# EAGLE design RAMPSXB (EAGLE 8.2.2)
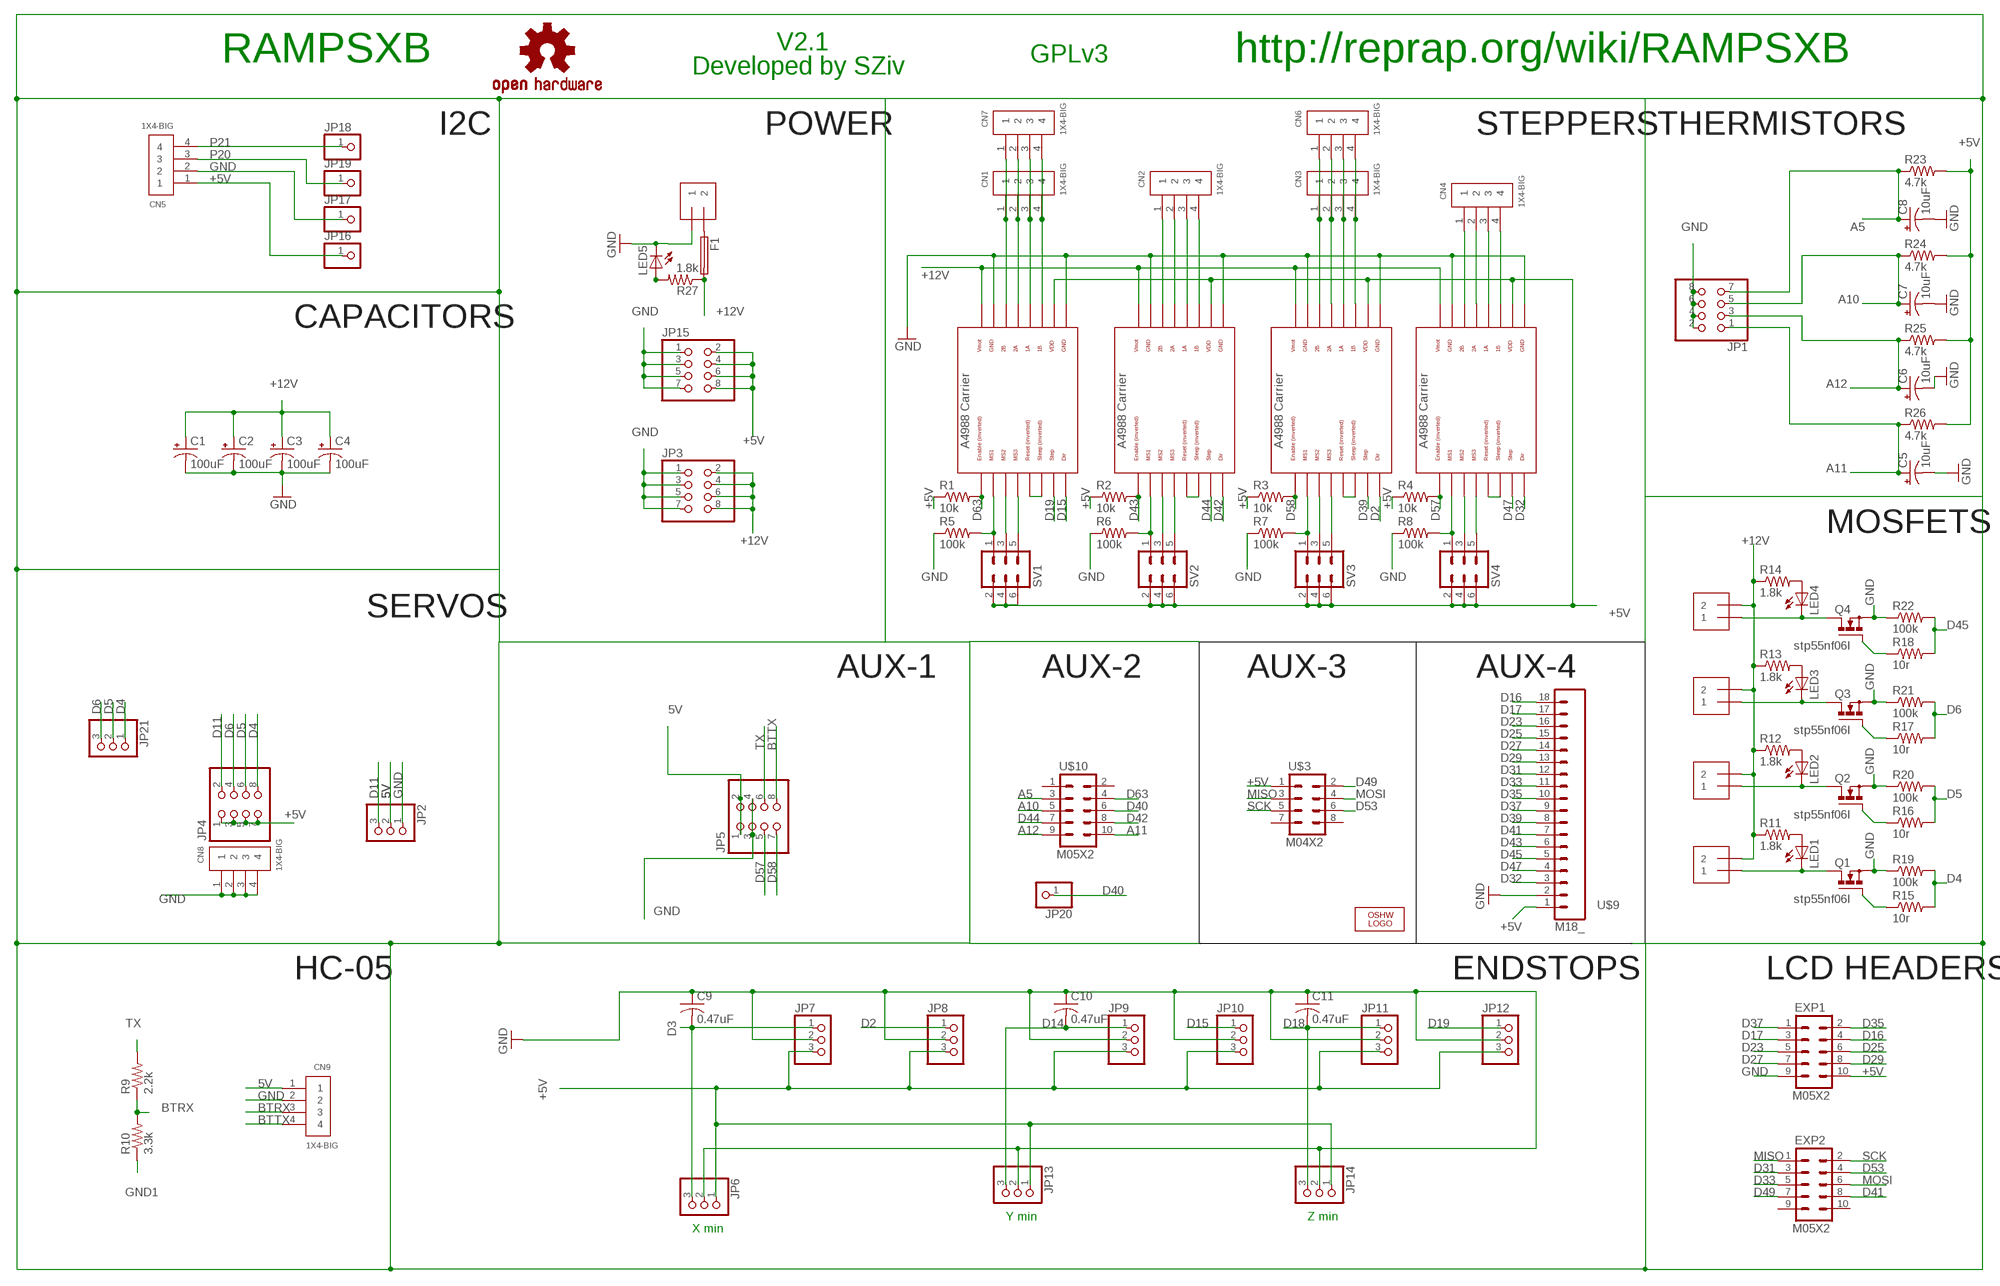
[diagram p0: schematic, sheet 1]

## Parts
C1  100uF  CPOL-US153CLV-0605  [153CLV-0605]
C2  100uF  CPOL-US153CLV-0605  [153CLV-0605]
C3  100uF  CPOL-US153CLV-0605  [153CLV-0605]
C4  100uF  CPOL-US153CLV-0605  [153CLV-0605]
C5  10uF  CPOL-US153CLV-0405  [153CLV-0405]
C6  10uF  CPOL-US153CLV-0405  [153CLV-0405]
C7  10uF  CPOL-US153CLV-0405  [153CLV-0405]
C8  10uF  CPOL-US153CLV-0405  [153CLV-0405]
C9  0.47uF  C-USC0805  [C0805]
C10  0.47uF  C-USC0805  [C0805]
C11  0.47uF  C-USC0805  [C0805]
CN1  1X4-BIG  [1X04-BIG]
CN2  1X4-BIG  [1X04-BIG]
CN3  1X4-BIG  [1X04-BIG]
CN4  1X4-BIG  [1X04-BIG]
CN5  1X4-BIG  [1X04-BIG]
CN6  1X4-BIG  [1X04-BIG]
CN7  1X4-BIG  [1X04-BIG]
CN8  1X4-BIG  [1X04-BIG]
CN9  1X4-BIG  [1X04-BIG]
EXP1  M05X2  [2X5]
EXP2  M05X2  [2X5]
F1  PTCFUSE  [LITTLEFUSE]
J1  1X2-3.5MM  [1X2-3.5MM]
J2  1X2-3.5MM  [1X2-3.5MM]
J3  1X2-3.5MM  [1X2-3.5MM]
J4  1X2-3.5MM  [1X2-3.5MM]
J5  1X2-3.5MM  [1X2-3.5MM]
JP1  PINHD-2X4  [2X04]
JP2  PINHD-1X3  [1X03]
JP3  PINHD-2X4  [2X04]
JP4  PINHD-2X4  [2X04]
JP5  PINHD-2X4  [2X04]
JP6  PINHD-1X3  [1X03]
JP7  PINHD-1X3  [1X03]
JP8  PINHD-1X3  [1X03]
JP9  PINHD-1X3  [1X03]
JP10  PINHD-1X3  [1X03]
JP11  PINHD-1X3  [1X03]
JP12  PINHD-1X3  [1X03]
JP13  PINHD-1X3  [1X03]
JP14  PINHD-1X3  [1X03]
JP15  PINHD-2X4  [2X04]
JP16  PINHD-1X1  [1X01]
JP17  PINHD-1X1  [1X01]
JP18  PINHD-1X1  [1X01]
JP19  PINHD-1X1  [1X01]
JP20  PINHD-1X1  [1X01]
JP21  PINHD-1X3  [1X03]
LED1  LEDCHIPLED_0805  [CHIPLED_0805]
LED2  LEDCHIPLED_0805  [CHIPLED_0805]
LED3  LEDCHIPLED_0805  [CHIPLED_0805]
LED4  LEDCHIPLED_0805  [CHIPLED_0805]
LED5  LEDCHIPLED_0805  [CHIPLED_0805]
LOGO1  OSHW_LOGO_6MILX0100-NT  [OSHW_6X100_NOTEXT]
LOGO2  OSHW-LOGOL  [OSHW-LOGO-L]
Q1  IRF512  [TO220BV]
Q2  IRF512  [TO220BV]
Q3  IRF512  [TO220BV]
Q4  IRF512  [TO220BV]
R1  10k  R-US_M0805  [M0805]
R2  10k  R-US_M0805  [M0805]
R3  10k  R-US_M0805  [M0805]
R4  10k  R-US_M0805  [M0805]
R5  100k  R-US_M0805  [M0805]
R6  100k  R-US_M0805  [M0805]
R7  100k  R-US_M0805  [M0805]
R8  100k  R-US_M0805  [M0805]
R9  2.2k  R-US_M0805  [M0805]
R10  3.3k  R-US_M0805  [M0805]
R11  1.8k  R-US_M0805  [M0805]
R12  1.8k  R-US_M0805  [M0805]
R13  1.8k  R-US_M0805  [M0805]
R14  1.8k  R-US_M0805  [M0805]
R15  10r  R-US_M0805  [M0805]
R16  10r  R-US_M0805  [M0805]
R17  10r  R-US_M0805  [M0805]
R18  10r  R-US_M0805  [M0805]
R19  100k  R-US_M0805  [M0805]
R20  100k  R-US_M0805  [M0805]
R21  100k  R-US_M0805  [M0805]
R22  100k  R-US_M0805  [M0805]
R23  4.7k  R-US_R0805  [R0805]
R24  4.7k  R-US_R0805  [R0805]
R25  4.7k  R-US_R0805  [R0805]
R26  4.7k  R-US_R0805  [R0805]
R27  1.8k  R-US_M0805  [M0805]
SV1  MA03-2  [MA03-2]
SV2  MA03-2  [MA03-2]
SV3  MA03-2  [MA03-2]
SV4  MA03-2  [MA03-2]
U$1  POLOLU_A4983CARRIER  [A4988BREAKOUT]
U$2  POLOLU_A4983CARRIER  [A4988BREAKOUT]
U$3  M04X2  [2X4]
U$4  POLOLU_A4983CARRIER  [A4988BREAKOUT]
U$5  POLOLU_A4983CARRIER  [A4988BREAKOUT]
U$9  M18_  [1X18]
U$10  M05X2  [2X5]

## Nets
5V: CN9.1 JP2.2 JP5.1 JP5.2
+5V: CN5.1 EXP1.10 JP4.1 JP4.3 JP4.5 JP4.7 JP6.1 JP7.3 JP8.3 JP9.3 JP10.3 JP11.3 JP12.3 JP13.1 JP14.1 JP15.2 JP15.4 JP15.6 JP15.8 JP16.1 R1.1 R2.1 R3.1 R4.1 R23.2 R24.2 R25.2 R26.2 SV1.2 SV1.4 SV1.6 SV2.2 SV2.4 SV2.6 SV3.2 SV3.4 SV3.6 SV4.2 SV4.4 SV4.6 U$1.VDD U$2.VDD U$3.1 U$4.VDD U$5.VDD U$9.1
+12V: C1.+ C2.+ C3.+ C4.+ F1.2 J2.2 J3.2 J4.2 J5.2 JP3.2 JP3.4 JP3.6 JP3.8 R11.1 R12.1 R13.1 R14.1 R27.1 U$1.VMOT U$2.VMOT U$4.VMOT U$5.VMOT
A5: C8.+ JP1.7 R23.1 U$10.3
A10: C7.+ JP1.5 R24.1 U$10.5
A11: C5.+ JP1.1 R26.1 U$10.10
A12: C6.+ JP1.3 R25.1 U$10.9
BTRX: CN9.3 R9.1 R10.2
BTTX: CN9.4 JP5.8
D2: JP8.1 U$4.DIR
D3: C9.2 JP6.3 JP7.1
D4: JP4.8 JP21.1 R15.2 R19.2
D5: JP4.6 JP21.2 R16.2 R20.2
D6: JP4.4 JP21.3 R17.2 R21.2
D11: JP2.3 JP4.2
D14: C10.2 JP9.1 JP13.3
D15: JP10.1 U$1.DIR
D16: EXP1.4 U$9.18
D17: EXP1.3 U$9.17
D18: C11.2 JP11.1 JP14.3
D19: JP12.1 U$1.STEP
D23: EXP1.5 U$9.16
D25: EXP1.6 U$9.15
D27: EXP1.7 U$9.14
D29: EXP1.8 U$9.13
D31: EXP2.3 U$9.12
D32: U$5.DIR U$9.3
D33: EXP2.5 U$9.11
D35: EXP1.2 U$9.10
D37: EXP1.1 U$9.9
D39: U$4.STEP U$9.8
D40: JP20.1 U$10.6
D41: EXP2.8 U$9.7
D42: U$2.DIR U$10.8
D43: R2.2 U$2.EN U$9.6
D44: U$2.STEP U$10.7
D45: R18.2 R22.2 U$9.5
D47: U$5.STEP U$9.4
D49: EXP2.7 U$3.2
D53: EXP2.4 U$3.6
D57: JP5.5 R4.2 U$5.EN
D58: JP5.7 R3.2 U$4.EN
D63: R1.2 U$1.EN U$10.4
GND: C1.- C2.- C3.- C4.- C5.- C6.- C7.- C8.- C9.1 C10.1 C11.1 CN5.2 CN8.1 CN8.2 CN8.3 CN8.4 CN9.2 EXP1.9 J1.1 JP1.2 JP1.4 JP1.6 JP1.8 JP2.1 JP3.1 JP3.3 JP3.5 JP3.7 JP5.3 JP5.4 JP6.2 JP7.2 JP8.2 JP9.2 JP10.2 JP11.2 JP12.2 JP13.2 JP14.2 JP15.1 JP15.3 JP15.5 JP15.7 JP17.1 LED5.C Q1.S Q2.S Q3.S Q4.S R5.1 R6.1 R7.1 R8.1 R19.1 R20.1 R21.1 R22.1 U$1.GND U$1.GND@0(GND) U$2.GND U$2.GND@0(GND) U$4.GND U$4.GND@0(GND) U$5.GND U$5.GND@0(GND) U$9.2
GND1: R10.1
MISO: EXP2.1 U$3.3
MOSI: EXP2.6 U$3.4
N$1: CN1.1 CN7.1 U$1.2B
N$2: LED5.A R27.2
N$3: CN1.3 CN7.3 U$1.1A
N$4: CN1.4 CN7.4 U$1.1B
N$5: CN2.1 U$2.2B
N$6: CN2.2 U$2.2A
N$7: CN2.3 U$2.1A
N$8: CN2.4 U$2.1B
N$9: CN3.1 CN6.1 U$4.2B
N$10: CN3.2 CN6.2 U$4.2A
N$11: CN3.3 CN6.3 U$4.1A
N$12: CN3.4 CN6.4 U$4.1B
N$13: CN4.1 U$5.2B
N$14: CN4.2 U$5.2A
N$15: CN4.3 U$5.1A
N$16: CN4.4 U$5.1B
N$17: F1.1 J1.2
N$18: R5.2 SV1.1 U$1.MS1
N$19: SV1.3 U$1.MS2
N$20: SV1.5 U$1.MS3
N$21: R6.2 SV2.1 U$2.MS1
N$22: SV2.3 U$2.MS2
N$23: SV2.5 U$2.MS3
N$24: R7.2 SV3.1 U$4.MS1
N$25: SV3.3 U$4.MS2
N$26: SV3.5 U$4.MS3
N$27: R8.2 SV4.1 U$5.MS1
N$28: SV4.3 U$5.MS2
N$29: SV4.5 U$5.MS3
N$30: J2.1 LED1.C Q1.D
N$32: U$2.RST U$2.SLP(SLEEP)
N$33: U$1.RST U$1.SLP(SLEEP)
N$34: U$4.RST U$4.SLP(SLEEP)
N$35: U$5.RST U$5.SLP(SLEEP)
N$36: J3.1 LED2.C Q2.D
N$37: J4.1 LED3.C Q3.D
N$38: J5.1 LED4.C Q4.D
N$39: LED1.A R11.2
N$40: LED2.A R12.2
N$41: LED3.A R13.2
N$42: LED4.A R14.2
N$44: CN1.2 CN7.2 U$1.2A
N$46: Q2.G R16.1
N$47: Q3.G R17.1
N$48: Q4.G R18.1
N$49: Q1.G R15.1
P20: CN5.3 JP19.1
P21: CN5.4 JP18.1
SCK: EXP2.2 U$3.5
TX: JP5.6 R9.2
Unconnected: EXP2.9 EXP2.10 U$3.7 U$3.8 U$10.1 U$10.2

## Notes on the sheet
- V2.1
- RAMPSXB | GPLv3 | http://reprap.org/wiki/RAMPSXB
- Developed by SZiv
- I2C | POWER | STEPPERS | THERMISTORS
- CAPACITORS
- MOSFETS
- SERVOS
- stp55nf06l
- AUX-1 | AUX-2 | AUX-3 | AUX-4
- stp55nf06l
- stp55nf06l
- stp55nf06l
- HC-05 | ENDSTOPS | LCD HEADERS
- Y min | Z min
- X min

## Library data of the parts
C1-C8 = adafruit:CPOL-US: POLARIZED CAPACITOR, American symbol
C9-C11 = adafruit:C-US: CAPACITOR, American symbol
CN1-CN9 = adafruit:1X4: 4-pin connector
EXP1 EXP2 U$10 = RepRapjr:M05X2
F1 = RAMPS:PTCFUSE: LITTLEFUSE Picofuse/slow Littlefuse
J1-J5 = adafruit:1X2: 3.5mm Terminal block http://www.ladyada.net/library/pcb/eaglelibrary.html
JP1 JP3-JP5 JP15 = adafruit:PINHD-2X4: PIN HEADER
JP2 JP6-JP14 JP21 = adafruit:PINHD-1X3: PIN HEADER
JP16-JP20 = adafruit:PINHD-1X1: Pin header 1x1 for 0.1" spacing With round pins
LED1-LED5 = adafruit:LED: LED OSRAM: - CHIPLED LG R971, LG N971, LY N971, LG Q971, LY Q971, LO R971, LY R971 LH N974, LH R974 LS Q976, LO Q976, LY Q976 LO Q996 - Hyper CHIPLED LW Q18S LB Q993, LB Q99A, LB R99A - SideLED LS A670, LO A670, LY A670, LG A670, LP A670 LB A673, LV A673, LT A673, LW A673 LH A674 LY A675 LS A676, LA A676, LO A676, LY A676, LW A676 LS A679, LY A679, LG A679 - Hyper Micro SIDELED® LS Y876, LA Y876, LO Y876, LY Y876 LT Y87S - SmartLED LW L88C, LW L88S LB L89C, LB L89S, LG L890 LS L89K, LO L89K, LY L89K LS L896, LA L896, LO L896, LY L896 - TOPLED LS T670, LO T670, LY T670, LG T670, LP T670 LSG T670, LSP T670, LSY T670, LOP T670, LYG T670 LG T671, LOG T671, LSG T671 LB T673, LV T673, LT T673, LW T673 LH T674 LS T676, LA T676, LO T676, LY T676, LB T676, LH T676, LSB T676, LW T676 LB T67C, LV T67C, LT T67C, LS T67K, LO T67K, LY T67K, LW E67C LS E67B, LA E67B, LO E67B, LY E67B, LB E67C, LV E67C, LT E67C LW T67C LS T679, LY T679, LG T679 LS T770, LO T770, LY T770, LG T770, LP T770 LB T773, LV T773, LT T773, LW T773 LH T774 LS E675, LA E675, LY E675, LS T675 LS T776, LA T776, LO T776, LY T776, LB T776 LHGB T686 LT T68C, LB T68C - Hyper Mini TOPLED® LB M676 - Mini TOPLED Santana® LG M470 LS M47K, LO M47K, LY M47K Source: http://www.osram.convergy.de/
LOGO1 = OSHW:OSHW_LOGO_6MIL
LOGO2 = SparkFun-Aesthetics:OSHW-LOGO: Open-Source Hardware (OSHW) Logo This logo indicates the piece of hardware it is found on incorporates a OSHW license and/or adheres to the definition of open source hardware found here: http://freedomdefined.org/OSHW
Q1-Q4 = transistor-power:IRF512: N-CHANNEL MOS FET
R1-R27 = adafruit:R-US_: RESISTOR, American symbol
SV1-SV4 = con-lstb:MA03-2: PIN HEADER; OC_FARNELL: unknown; OC_NEWARK: unknown
U$1 U$2 U$4 U$5 = RAMPS:POLOLU_A4983CARRIER
U$3 = SparkFun:M04X2
U$9 = SparkFun:M18

## Board
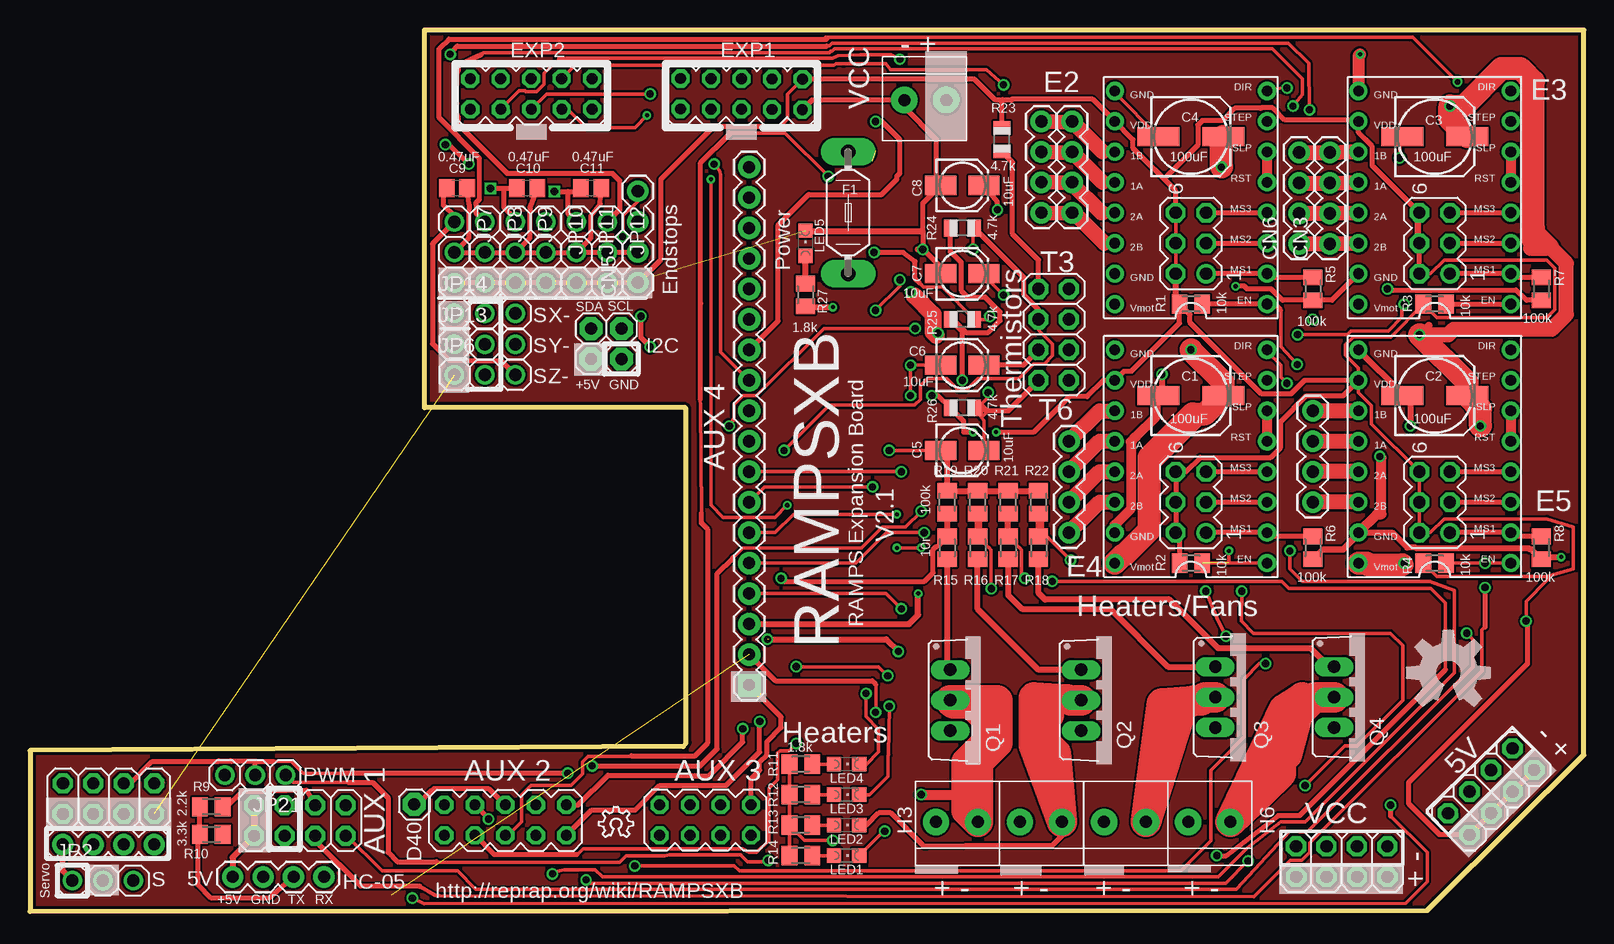
[diagram p1: board, top side]
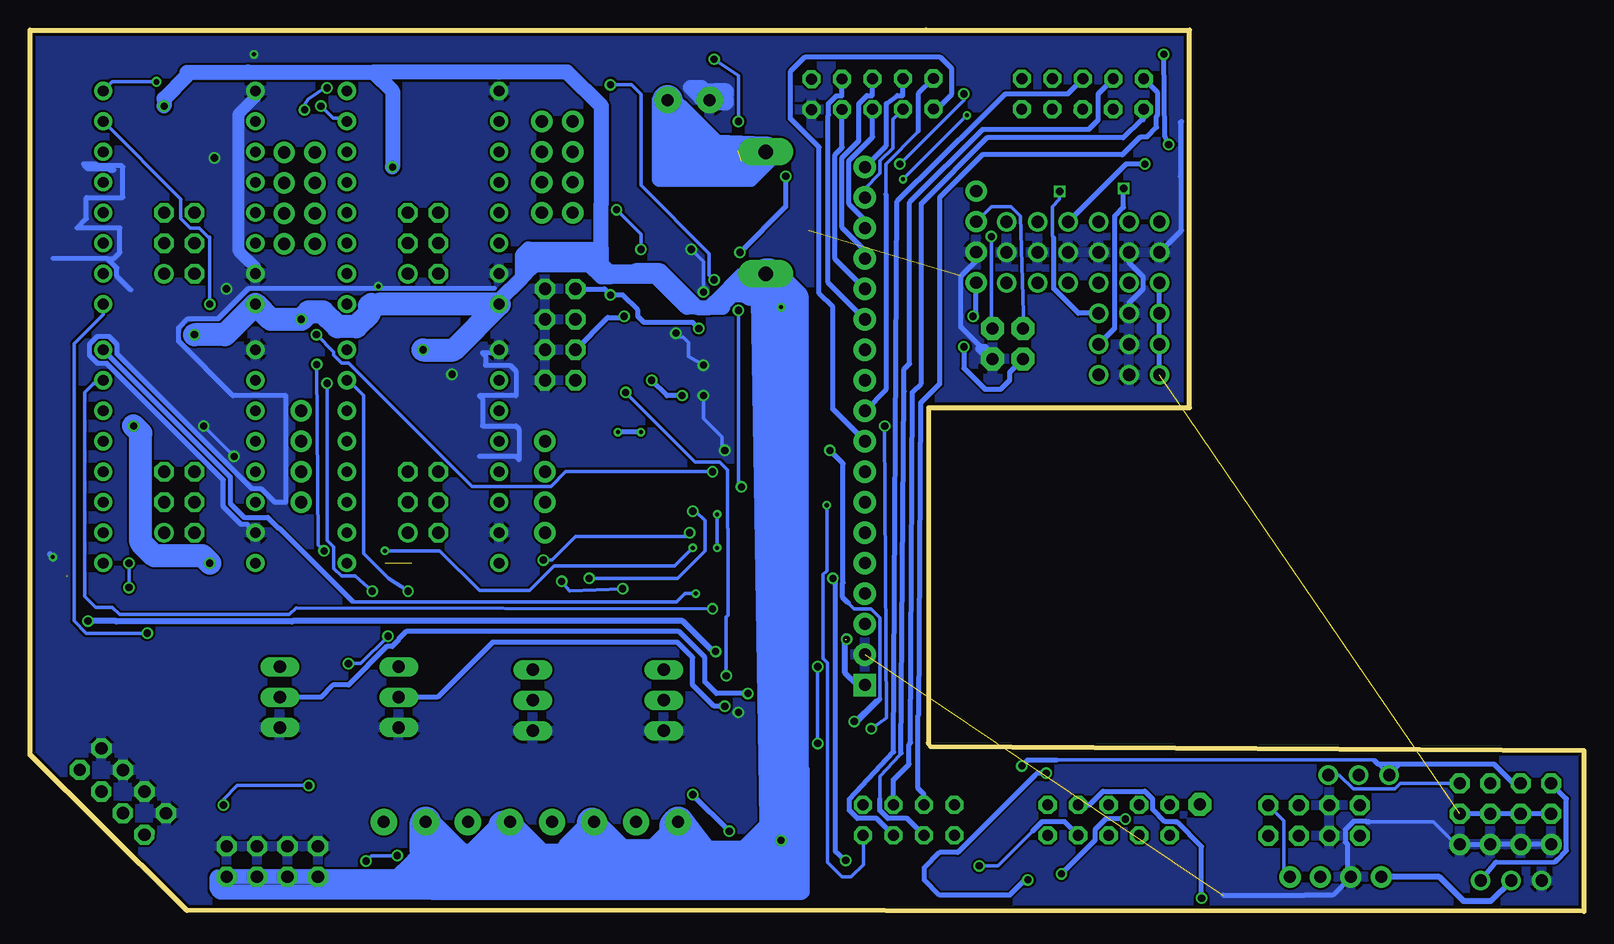
[diagram p2: board, bottom side, seen from below]

Size 129.54 x 73.48 mm. Coordinates in mm from the lower left corner, seen from the top.
Outline: 54.46,13.74 0,13.41 0,0 116.46,0.08 117.22,0.84 129.54,13.03 129.54,73.48 54.86,73.48
Outline: 54.84,73.48 32.89,73.48 32.89,41.99 54.64,41.99 54.64,13.94
Outline: 54.48,13.79 54.74,14.05
Copper layers (1*16): Top 0.035mm / dielectric 1.5mm / Bottom 0.035mm
Design rules "GoldPhoenix *": minimum track width 7mil, minimum drill 16mil, track to track 7mil, track to pad 7mil, pad to pad 7mil, via to via 7mil, smd to smd 7mil, copper to edge 10mil, drill to drill 8mil, minimum pad ring 12mil, minimum via ring 7mil, stop-mask expansion 4mil, vias tented up to drill 25mil, thermal gap 10mil

### Footprints (pad centres in the part's own frame; a part is rotated, then mirrored left to right if it is on the bottom)
153CLV-0605 = smd 3.5 x 1.6: + 2.7,0; - -2.7,0
153CLV-0405 = smd 2.6 x 1.6: + 1.8,0; - -1.8,0
C0805 = smd 1.3 x 1.5: 1 -0.85,0; 2 0.85,0
1X04-BIG = drill 1.016 pad 1.778: 1 0,0; 2 2.54,0; 3 5.08,0; 4 7.62,0
2X5 = drill 0.9 pad 1.422 octagon: 1 -3.81,-1.27; 2 -3.81,1.27; 3 -1.27,-1.27; 4 -1.27,1.27; 5 1.27,-1.27; 6 1.27,1.27; 7 3.81,-1.27; 8 3.81,1.27; 9 6.35,-1.27; 10 6.35,1.27
LITTLEFUSE = drill 1.2 pad 2.3 long: 1 -5.08,0; 2 5.08,0
1X2-3.5MM = drill 1 pad 2.184: 1 1.8,0; 2 -1.7,0
2X04 = drill 1.016 pad 1.676 octagon: 1 -3.81,-1.27; 2 -3.81,1.27; 3 -1.27,-1.27; 4 -1.27,1.27; 5 1.27,-1.27; 6 1.27,1.27; 7 3.81,-1.27; 8 3.81,1.27
1X03 = drill 1.016: 1 -2.54,0; 2 0,0; 3 2.54,0
1X01 = drill 1.016 pad 1.93 octagon: 1 0,0
CHIPLED_0805 = smd 1.2 x 1.2: A 0,-1.05; C 0,1.05
TO220BV = drill 1.016 long: D 0,-2.54; G -2.54,-2.54; S 2.54,-2.54
M0805 = smd 1.3 x 1.6: 1 -0.95,0; 2 0.95,0
R0805 = smd 1.1 x 1.4: 1 -1,0; 2 1,0
MA03-2 = drill 1.016: 1 -2.54,-1.27 | drill 1.016 octagon: 2 -2.54,1.27; 3 0,-1.27; 4 0,1.27; 5 2.54,-1.27; 6 2.54,1.27
A4988BREAKOUT = drill 0.9: 1A 8.89,1.27; 1B 11.43,1.27; 2A 6.35,1.27; 2B 3.81,1.27; DIR 16.51,-11.43; EN -1.27,-11.43; GND 16.51,1.27; GND@0 1.27,1.27; MS1 1.27,-11.43; MS2 3.81,-11.43; MS3 6.35,-11.43; RST 8.89,-11.43; SLP 11.43,-11.43; STEP 13.97,-11.43; VDD 13.97,1.27; VMOT -1.27,1.27
2X4 = drill 0.9 pad 1.422 octagon: 1 -3.81,-1.27; 2 -3.81,1.27; 3 -1.27,-1.27; 4 -1.27,1.27; 5 1.27,-1.27; 6 1.27,1.27; 7 3.81,-1.27; 8 3.81,1.27
1X18 = drill 1.016 pad 1.88 square: 1 0,0 | drill 1.016 pad 1.88: 2 2.54,0; 3 5.08,0; 4 7.62,0; 5 10.16,0; 6 12.7,0; 7 15.24,0; 8 17.78,0; 9 20.32,0; 10 22.86,0; 11 25.4,0; 12 27.94,0; 13 30.48,0; 14 33.02,0; 15 35.56,0; 16 38.1,0; 17 40.64,0; 18 43.18,0

### Placement (x,y rotation side)
C1  96.77,64.59 0 top
C2  117.09,64.59 0 top
C3  117.09,43 0 top
C4  96.77,43 0 top
C5  77.72,53.16 0 top
C6  77.72,60.53 0 top
C7  77.72,45.54 0 top
C8  77.72,38.43 0 top
C9  35.59,60.27 180 top
C10  41.43,60.27 180 top
C11  46.76,60.27 180 top
CN1  86.87,58.24 90 top
CN2  86.61,31.57 90 top
CN3  108.36,55.65 90 top
CN4  106.93,34.11 90 top
CN5  50.67,52.43 90 top
CN6  105.79,55.65 90 top
CN7  84.3,58.24 90 top
CN8  2.73,5.58 0 top
CN9  16.89,2.87 0 top
EXP1  58.04,68.15 359.7 top
EXP2  40.51,68.15 0.1 top
F1  68.2,58.24 270 top
J1  74.68,67.64 180 top
J2  77.22,7.44 0 top
J3  84.23,7.44 0 top
J4  91.24,7.44 0 top
J5  98.25,7.44 0 top
JP1  85.34,48.08 270 top
JP2  6.07,2.57 0 top
JP3  109.35,4.14 180 top
JP4  6.55,9.4 0 top
JP5  22.5,7.57 0 top
JP6  37.92,44.73 0 top
JP7  35.38,54.94 270 top
JP8  37.92,54.94 270 top
JP9  40.46,54.94 270 top
JP10  43,54.94 270 top
JP11  45.54,54.94 270 top
JP12  48.13,54.94 270 top
JP13  37.92,47.27 0 top
JP14  37.92,49.86 0 top
JP15  121.79,9.98 225.1 top
JP16  46.76,46.05 0 top
JP17  49.3,46.05 0 top
JP18  49.3,48.59 0 top
JP19  46.76,48.59 0 top
JP20  32.03,8.92 0 top
JP21  18.77,11.35 180 top
LED1  68.07,4.65 270 top
LED2  68.07,7.19 270 top
LED3  68.07,9.73 270 top
LED4  68.07,12.27 270 top
LED5  64.64,55.7 0 top
LOGO1  47.43,6.17 0 top
LOGO2  118.24,19.89 0 top
Q1  79.25,17.6 270 top
Q2  90.17,17.6 270 top
Q3  101.35,17.86 270 top
Q4  111.25,17.86 270 top
R1  96.77,50.62 0 top
R2  96.77,29.03 0 top
R3  117.09,50.62 0 top
R4  117.09,29.03 0 top
R5  106.93,51.89 90 top
R6  106.93,30.3 90 top
R7  125.98,51.89 90 top
R8  125.98,30.3 90 top
R9  15.11,8.71 0 top
R10  15.11,6.43 180 top
R11  64.26,4.65 0 top
R12  64.26,7.19 0 top
R13  64.26,9.73 0 top
R14  64.26,12.27 0 top
R15  76.45,30.3 90 top
R16  78.99,30.3 90 top
R17  81.53,30.3 90 top
R18  84.07,30.3 90 top
R19  76.45,34.11 270 top
R20  78.99,34.11 270 top
R21  81.53,34.11 270 top
R22  84.07,34.11 270 top
R23  77.72,41.99 180 top
R24  77.72,49.35 180 top
R25  77.72,56.97 180 top
R26  81.03,64.34 90 top
R27  64.64,51.38 90 top
SV1  96.77,55.7 90 top
SV2  96.77,34.11 90 top
SV3  117.09,55.7 90 top
SV4  117.09,34.11 90 top
U$1  91.69,51.89 90 top
U$2  91.69,30.3 90 top
U$3  56.29,7.6 180 top
U$4  112.01,51.89 90 top
U$5  112.01,30.3 90 top
U$9  59.94,18.87 90 top
U$10  38.35,7.6 0 top

### Tracks (layer width: path | path; a pad name or v marks a point on that pad's centre or on a via)
5V
  Top 0.508: JP5.2 JP5.1 16.89,4.5 CN9.1
  Bottom 0.508: JP2.2 7.8,0.84 10.03,0.84 12.07,2.87 CN9.1
+5V  (via drill 0.35, 0.6)  (3 unrouted)
  Top 0.305: 81.85,67.62 81.89,67.74 | U$1.VDD 91.99,64.29 91.99,63.66 94.55,61.1 | 94.55,61.1 95.5,60.15 SV1.6 SV1.4 SV1.2 | U$4.VDD 110.74,64.86 111.83,63.77 111.83,62.24 115.67,58.4 SV3.6 115.82,55.83 SV3.4 SV3.2 116.75,53.16 117.89,54.31 126.44,54.31 127.11,53.63 127.11,50.16 126.45,49.49 117.26,49.49 116.13,50.62 | 115.82,50.62 116.13,50.62 | 116.13,50.62 R3.1 113.42,47.9 110.3,47.9 109.66,47.26 109.66,46.36 110.74,45.28 U$5.VDD 110.74,43.27 111.83,42.18 111.83,40.65 SV4.6 SV4.4 SV4.2 116.75,31.57 117.89,32.72 126.44,32.72 128.64,32.04 128.64,28.57 126.45,27.9 117.26,27.9 116.14,29.02 R4.1 | 94.71,61.26 94.55,61.1 | R23.2 76.78,41.92 | U$2.VDD 90.68,44.02 | 126.47,27.92 126.47,27.61 124.71,25.86 v124.71,24.21 | 62.56,65.47 63.13,66.04 63.13,68.12 EXP1.10
  Top 0.406: JP7.3 JP8.3 JP9.3 JP10.3 JP11.3 JP12.3 48.16,52.43 CN5.1 52.6,54.35 52.6,61.04 57.03,65.47 62.56,65.47 | v51.69,47.07 50.93,47.83 v50.93,49.61 | v124.71,24.21 124.84,24.08 124.84,20.65 114.94,10.74 114.94,8.97 117.51,6.39 JP15.8 JP15.6 JP15.4 JP15.2 | 81.08,67.67 80.42,67.67 78.71,69.39 EXP1.10 | 81.08,67.67 81.8,67.67 81.85,67.62 | 81.89,67.74 88.55,67.74 U$1.VDD 91.94,64.34 91.94,63.63 95.5,60.07 SV1.6 | R26.2 81.03,67.62 81.08,67.67 | R1.1 95.82,49.04 91.82,45.03 91.19,45.03 U$2.VDD 89.48,44.27 88.12,42.91 86.64,42.91 83.71,39.98 80.55,39.98 v80.53,39.95 | 76.78,41.92 77.84,40.86 77.84,39.95 v78.61,39.95 | v75.18,43 75.71,43 R23.2 | v77.72,44.27 77.72,48.35 R24.2 76.94,49.35 78.02,48.27 79.89,48.27 80.87,49.25 80.87,49.96 79.6,51.23 78.15,51.23 77.6,51.77 77.6,54.12 76.72,55 R25.2 | SV3.2 115.82,55.83 | 115.67,55.86 115.67,58.4 | SV3.6 111.88,62.19 111.88,63.79 110.74,64.93 U$4.VDD 110.64,65.97 104.62,65.97 103.59,67 102.65,67 102.6,66.95 100.41,66.95 99.39,65.93 97.72,65.93 97.34,65.55 97.34,63.89 94.71,61.26 | 95.7,50.75 96.69,49.75 96.69,49.1 102.65,43.14 105.11,43.14 106.24,44.27 U$5.VDD 109.47,43 106.41,43 104.26,40.85 104.27,40.85 104.27,38.68 103.43,37.85 97.55,37.85 96.36,36.65 SV2.6 SV2.4 SV2.2 95.82,31.25 R2.1 | U$3.1 60.1,11.03 60.83,11.76 60.83,12.46 61.42,13.04 61.42,14.12 62.61,15.32 62.61,16.21 U$9.1
  Top 0.508: R1.1 95.7,50.75 95.5,50.94 SV1.2 | v61.47,22.68 71.37,22.68 v72.39,21.67
  Bottom 0.406: JP7.3 JP14.1 JP13.1 JP6.1 | JP4.1 JP4.3 JP4.5 JP4.7 | v50.93,49.61 50.67,49.86 CN5.1 | 61.59,22.68 61.47,22.56 | 61.59,22.94 61.59,22.68 | 60.2,18.87 U$9.1 | v75.18,43 76.45,43 v77.72,44.27 | v51.69,47.07 51.69,45.29 49.91,43.51 48.63,43.51 47.88,44.26 47.88,44.93 JP16.1 | v78.61,39.95 v80.53,39.95 80.65,39.95 | 61.59,22.68 61.59,19.89
  Bottom 0.508: U$9.1 60.58,18.87 61.59,19.89 61.59,22.94 | v72.39,21.67 72.59,21.67 75.13,24.21 107.65,24.21 107.7,24.16 122.31,24.16 122.36,24.21 v124.71,24.21
+12V  (via drill 0.35, 0.6)
  Top 0.305: R11.1 R12.1 | R13.1 R12.1 | 63.31,10.38 R13.1 | R12.1 64.23,6.27 64.23,6.25 64.56,5.92 v66.93,5.92 | R14.1 R13.1
  Top 0.508: R27.1 64.71,50.37 v66.93,50.37
  Top 0.61: 116.6,48.86 v115.82,48.08
  Top 1.016: v114.55,29.03 U$5.VMOT | 92.96,36.49 C4.+
  Top 1.27: 126.84,55.27 128.08,54.03 128.08,49.76 126.85,48.53 118.68,48.53 118.24,48.08 v115.82,48.08 | 126.84,55.27 125.09,55.27 | 126.84,55.27 126.84,55.44 125.33,56.95
  Top 1.905: U$2.VMOT 91.08,29.69 91.2,29.69 93.3,31.78 93.3,37.88 96.9,41.48 97.95,41.48 C4.+ 99.47,44.11 v96.77,46.81 | U$5.VMOT 111.4,29.03 111.55,28.88 114.36,28.88 | v120.9,40.46 120.9,41.89 C3.+ 119.79,44.11 v115.82,48.08 | C2.+ 118.36,66.02 v118.36,67.13 119.51,67.13 122.66,70.29 124.22,70.29 125.33,69.18 125.33,56.95 125.33,55.98 125.35,55.96 | v99.31,62.05 99.31,64.43 C1.+
  Bottom 0.305: v66.93,5.92 65.91,5.92
  Bottom 0.406: 70.23,4.65 70.23,5.66 67.94,7.95 67.94,7.44 69.72,5.66 69.22,5.66 68.45,6.43
  Bottom 0.508: v66.93,50.37 66.17,51.13 65.91,51.13
  Bottom 1.016: 90.04,50.62 U$1.VMOT | 79.07,53.42 81.41,53.42 | 100.46,50.62 101.09,50.62
  Bottom 1.27: 89.41,7.44 J4.2 | 97.03,7.44 J5.2 95.88,7.44 93.6,5.16 95.12,5.16 95.12,5.66 | 90.04,5.41 92.84,2.62 93.09,2.62 | JP3.8 98.93,2.87 98.45,3.36 98.4,3.36 | JP3.8 JP3.6 JP3.4 JP3.2 | JP3.8 105.03,2.36 95.88,2.36 | 82.68,5.66 79.37,2.36 78.62,2.36 | 79.07,53.42 77.01,53.42 73.96,50.37 | 70.65,52.57 70.06,53.16 F1.2 69.47,53.16 69.47,52.4 | 71.86,51.35 70.65,52.57 | 71.86,51.35 72.85,50.37 | 95.38,2.34 96.12,1.6 | 113.92,2.87 113.92,1.85 113.67,1.6 96.12,1.6 | 96.65,5.16 97.64,4.16 97.64,4.11 98.4,3.36 | 98.4,3.36 98.17,3.12 96.65,3.12 97.16,3.63 97.41,3.63 | 96.12,1.6 65.15,1.6 65.15,11.76 | J2.2 73.83,5.76 73.83,4.65 | 72.52,4.65 75.06,7.95 77.6,5.41 80.14,5.41 82.17,7.44 J3.2 82.93,7.44 84.96,5.41 81.91,5.41 81.91,5.92 82.68,5.92 82.68,7.39 | J4.2 89.28,7.44 87,5.16 88.77,5.16 88.77,5.92 90.04,5.92 90.04,7.14 | J4.2 90.3,7.44 92.58,5.16 | 69.21,51.13 68.17,51.13 | 69.21,51.13 70.65,52.57 | 69.21,51.13 69.68,51.13 69.95,51.41 71.02,51.41 71.07,51.35 | 71.07,51.35 71.86,51.35 | v118.36,67.13 118.36,67.77 116.46,69.68 116.46,69.93 111.44,69.93 111.39,69.97 100.88,69.97 | 100.88,69.97 99.31,68.4 v99.31,62.05 | U$1.VMOT 90.42,50.95 88.52,52.85 | 81.41,53.42 81.94,53.95 81.94,55.22 | 81.94,55.22 81.94,59.03 81.91,59.05 81.91,67.13 84.75,69.97 100.88,69.97 | 88.52,52.85 88.52,54.69 87.99,55.22 81.94,55.22 | 73.96,50.37 73.94,50.35 72.87,50.35 72.85,50.37 | 73.96,50.37 74.8,50.37 77.34,52.91 81.15,52.91 82.68,54.43 87.76,54.43 | 87.76,54.43 87.25,53.92 82.93,53.92 81.91,52.91 81.41,52.91 | 88.52,52.85 87.76,53.61 87.76,54.43 | 72.85,50.37 71.78,50.37 71.78,50.65 71.07,51.35
  Bottom 1.905: v96.77,46.81 94.23,46.81 U$1.VMOT 100.46,50.62 | 101.09,50.62 101.24,50.47 101.24,49.84 102.34,48.74 103.91,48.74 105.14,49.97 106.32,49.97 v106.93,49.35 109.47,49.35 U$4.VMOT 113.28,48.08 v115.82,48.08 | v114.55,29.03 115.15,29.63 119.17,29.63 120.31,30.77 120.31,39.87 v120.9,40.46
  Bottom 2.54: 82.68,7.39 82.68,5.66 | 90.04,7.14 90.04,5.41 | J5.2 96.65,7.24 96.65,5.16 95.88,4.39 75.31,4.39 75.06,4.65 73.83,4.65 72.52,4.65 70.23,4.65 67.18,4.65 | J2.2 75.82,7.14 75.82,5.16 78.62,2.36 95.38,2.34 95.1,2.62 93.09,2.62 66.17,2.62 65.91,2.87 65.91,5.92 | 67.18,4.65 67.44,4.9 68.17,51.13 F1.2 67.94,53.16 65.91,51.13 65.91,5.92 | 67.18,4.65 65.91,5.92
A5  (via drill 0.6)
  Top 0.305: C8.+ 79.52,40.93 79.3,41.15 | 79.3,41.15 R23.1 79.3,42.31 | 79.3,42.31 79.88,42.89 v79.88,43.26 | v71.5,19.63 70.74,20.4 v63.88,20.4 | v63.88,14 63.28,13.4 62.52,13.4 62.33,13.21 62.33,10.97 61.59,10.24 61.59,5.92 60.58,4.9 59.94,4.9 59.39,5.2 53.47,5.2 52.2,5.22 46.09,5.22 45.59,4.72 | 79.3,41.18 79.3,42.31 | 79.3,41.15 79.3,41.18 | 79.3,41.18 79.86,41.73 79.86,41.76 79.3,42.31
  Top 0.406: R23.1 79.86,41.73 81.53,41.73 JP1.7 | U$10.3 38.69,4.72 45.59,4.72
  Bottom 0.305: v79.88,43.26 74.09,37.46 72.06,37.46 71.37,36.78 71.37,31.95 71.35,31.93 71.35,24.69 71.5,24.54 v71.5,19.63 | v63.88,20.4 v63.88,14
A10  (via drill 0.6)
  Top 0.305: 55.97,33.18 55.88,42.11 55.86,42.7 | v66.55,61.29 62.94,64.9 58.31,64.9 58.3,64.88 | v80.01,49.61 79.76,49.35 R24.1 76.04,52.03 74.49,52.03 74.29,52.23 74.29,52.26 74.14,52.41 | U$10.5 39.86,6.33 40.99,7.47 40.99,9.7 41.78,10.49 45.1,10.49 46.05,11.44 46.05,12.45 46.53,12.92 50.06,12.92 50.11,12.97
  Top 0.406: C7.+ 82.8,45.54 JP1.5 | 55.86,42.7 55.86,50.62 55.91,50.68 55.91,62.41 58.3,64.79 58.3,64.88 | 74.14,52.41 73.79,52.77 73.79,54.18 72.77,54.94 v70.36,54.94 | 50.11,12.97 55.44,12.97 56.52,14.05 56.52,31.83 55.98,32.37 55.98,33.17 55.97,33.18
  Bottom 0.406: JP1.5 81.38,49.51 80.11,49.51 v80.01,49.61 | v66.55,61.29 66.55,58.75 v70.36,54.94
A11  (via drill 0.6)
  Top 0.305: v59.41,15.21 59.31,15.32 | v73.79,48.59 66.17,48.59 60.58,43 59.42,43 58.67,42.26 58.67,41.1 v58.29,40.46 | v81.15,51.38 79.52,53.01 C5.+
  Top 0.406: 56.08,11.28 55.82,11.29 55.64,11.3 55.63,11.29 55.4,11.3 55.18,11.3 54.54,11.32 51.78,11.32 51.52,11.33 51.3,11.33 51.06,11.33 50.82,11.33 48.17,11.34 45.7,8.87 U$10.10 | 56.08,11.28 | 56.08,11.28 | 56.08,11.28 56.34,11.28 56.42,11.28 56.48,11.28 56.54,11.28 56.55,11.29 56.56,11.29 56.59,11.32 56.6,11.32 56.62,11.34 56.79,11.49 59.41,14.11 v59.41,15.21 | JP1.1 84.07,54.31 81.91,56.46 81.91,62.45 R26.1
  Bottom 0.305: v59.41,15.21 58.14,16.13 v58.29,40.46
  Bottom 0.406: JP1.1 81.66,51.89 v81.15,51.38 80.14,51.38 78.87,50.11 78.87,49.61 78.36,49.1 74.3,49.1 v73.79,48.59
A12  (via drill 0.6)
  Top 0.305: v60.83,15.82 60.83,14.55 | JP1.3 83.63,48.91 84.56,47.98 85.24,47.3 85.24,46.33 84.56,45.64 83.66,45.64 82.43,44.41 79.01,44.41 78.06,43.46 77.39,43.46 76.44,44.41 74.8,44.41 74.21,43.82 74.21,42.67 73.74,42.19 66.63,42.19 v62.87,38.43 | R25.1 78.61,56.86 v78.61,55.19
  Top 0.406: JP1.3 84.07,50.17 82.85,51.39 82.85,52.84 R25.1 | U$10.9 46.83,8.46 50.46,8.46 52.5,10.49 58.04,10.49 60.83,13.28 v60.83,15.82 | v80.65,58.5 80.65,59.15 C6.+
  Bottom 0.305: v60.83,15.82 59.05,17.6 58.87,17.6 58.67,17.8 58.67,24.48 59.42,25.22 60.83,25.22 61.34,25.73 | v78.61,55.19 78.61,56.46 v80.65,58.5
  Bottom 0.406: 61.34,25.73 61.8,26.18 61.8,27.36 61.75,27.41 61.75,37.32 v62.87,38.43 | v60.83,15.82 60.57,15.82 58.7,17.7
BTRX
  Top 0.406: R9.1 R10.2 14,6.26 14,2.21 15.11,1.09 19.96,1.09 21.99,2.87 CN9.3
BTTX
  Bottom 0.305: JP5.8 25.02,7.54 25.02,3.12 24.77,2.87 CN9.4
D2  (via drill 0.45 pad 0.55)
  Top 0.305: 66.17,72.72 66.32,72.87 66.57,72.87 | 66.42,72.72 66.57,72.87 | v119,69.16 115.29,72.87 66.57,72.87
  Top 0.406: 37.92,57.94 JP8.1 37.2,58.21 37.21,58.8 37.19,59 37.19,59.14 37.24,59.14 37.47,59.37 37.47,62.76 34.11,66.16 34.11,71.96 34.16,71.96 34.92,72.72 66.42,72.72
  Bottom 0.305: v119,69.16 122.68,69.16 U$4.DIR
D3
  Top 0.406: C9.2 34.92,60.71 34.68,60.71 34.45,60.49 34.45,58.87 35.38,57.94 JP7.1 35.37,57.48 33.55,55.67 33.55,47.32 34.92,45.95 34.92,45.92 39.27,45.92 JP6.3
D4  (via drill 0.6)
  Top 0.305: 26.54,10.74 21.92,10.74 JP21.1 | v61.54,4.24 61.44,4.14 59.82,4.14 59.27,4.69 59.27,4.72 53.66,4.72 53.47,4.72 53.27,4.72 52.95,4.65 52.76,4.65 49.68,4.65 49.13,4.09 33.91,4.09
  Top 0.406: 11.05,10.74 JP4.8 | v62.61,27.76 62.87,27.51 74.55,27.51 75.27,28.23 75.27,30.16 75.5,30.38 75.59,30.38 R15.2 | 33.91,4.09 33.86,4.14 30.61,4.14 29.84,4.9 29.84,9.47 28.57,10.74 26.54,10.74
  Top 0.508: R19.2 R15.2
  Bottom 0.305: JP21.1 20.39,11.35 19.24,10.21 15.76,10.21 15.3,10.67 JP4.8
  Bottom 0.406: v61.54,4.24 62.42,5.03 62.42,27.57 v62.61,27.76
D5  (via drill 0.6)
  Top 0.305: v46.36,2.62 46.63,2.34 99.67,2.34 v101.52,4.19 | 117.98,20.14 117.98,25.73 116.78,26.94 104.92,26.94 104.35,27.51 v85.22,27.51 | R16.2 79.1,31.14 79.91,30.33 79.93,30.33 80.12,30.14 80.12,27.01 v80.14,26.9 | 26.04,11.51 22.77,11.51 21.78,12.5 20.3,12.5 19.91,12.5 | 16.7,12.5 10.21,12.5
  Top 0.406: R16.2 R20.2 | v44.83,11.51 26.04,11.51 | v98.93,4.65 99.75,4.65 104.05,7.98 104.08,8 105.84,8 117.98,20.14 | JP4.6 8.38,10.67 10.21,12.5 15.68,12.5 15.74,12.55 16.73,12.55 16.78,12.5 18.9,12.5 | 18.9,12.5 20.3,12.5 | JP21.2 18.77,12.37 18.9,12.5
  Top 0.508: R20.2 79.1,33.05 79.1,31.14
  Bottom 0.305: v85.22,27.51 84.56,26.7 v80.14,26.9 | v98.93,4.65 101.07,4.65 v101.52,4.19 | 45.59,11.51 45.75,11.35
  Bottom 0.406: v46.36,2.62 46.61,2.62 47.88,1.35 53.72,1.35 54.99,2.62 54.99,3.63 53.72,4.9 52.2,4.9 45.75,11.35 | v44.83,11.51 45.59,11.51
D6  (via drill 0.6)
  Top 0.305: v74.3,33.35 73,32.06 71.08,32.06 69.33,30.3 59.42,30.3 58.6,29.48 | v82.93,27.76 82.66,28.03 82.66,30.14 82.47,30.33 82.45,30.33 R17.2
  Top 0.406: v46.86,12.12 55.86,12.12 57.28,13.54 57.28,28.16 58.6,29.48
  Top 0.508: R17.2 R21.2
  Bottom 0.305: 43.97,12.62 17.5,12.62 17.44,12.56 JP21.3 15.32,12.27 7.49,12.27 | v74.3,33.35 74.04,33.35 73.28,32.59 73.28,30.05 75.56,27.76 v82.93,27.76
  Bottom 0.406: 43.97,12.62 46.36,12.62 v46.86,12.12 | JP4.4 5.89,10.67 7.49,12.27 17.14,12.27 17.44,12.56
D11
  Bottom 0.406: JP2.3 7.34,4.09 2.41,4.13 2.24,4.31 2.2,4.31 1.46,5.05 1.46,9.39 JP4.2
D14  (via drill 0.6)
  Top 0.406: 40.46,57.74 40.46,57.94 | 40.46,57.74 JP9.1 | v38.38,60.27 39.5,60.27 | 39.5,60.27 C10.2 | 39.5,60.27 39.5,58.71 40.46,57.74
  Bottom 0.406: v38.38,60.27 38.38,58.71 39.12,57.97 39.12,48.62 JP13.3
D15  (via drill 0.6)
  Top 0.305: 66.42,72.14 66.47,72.19 66.64,72.19 66.84,72.39 104.89,72.39 106.58,70.69 v106.66,66.83 | v104.78,68.66 103.12,68.53 U$1.DIR
  Top 0.406: v36.6,62.31 34.67,64.08 v34.62,63.93 | v35.03,71.45 35.61,72.14 66.42,72.14
  Bottom 0.305: v106.66,66.83 106.6,67.34 106.34,67.72 104.78,68.78 v104.78,68.66
  Bottom 0.406: v34.62,63.93 34.92,64.59 v35.03,71.45 | v36.6,62.31 38.18,62.31 JP10.1
D16
  Bottom 0.406: EXP1.4 56.78,68.02 57.24,68.02 58.16,67.35 58.16,63.84 U$9.18
D17
  Bottom 0.305: EXP1.3 57.62,66.03 57.62,63.62 58.67,62.57 58.67,61.53 59.94,60.26 U$9.17
D18  (via drill 0.6)
  Top 0.406: v43.71,60.02 44.83,60.02 | 44.83,60.02 45.66,60.02 C11.2 | 44.83,60.02 44.83,58.19 JP11.1
  Bottom 0.305: v43.71,60.02 43.71,59.36 44.32,58.75 44.32,56.3 44.2,56.17
  Bottom 0.406: JP14.3 42.15,49.86 44.2,51.91 44.2,56.17
D19  (via drill 0.6)
  Top 0.305: v105.28,67.13 106.05,68.1 106.05,69.42 103.56,71.91 67.05,71.91 66.84,71.7 66.74,71.7 66.64,71.6 37.78,71.6 37.63,71.45 | 48.18,57.53 JP12.1
  Top 0.406: 37.63,71.45 36.8,71.08 35.78,70.59 35.69,70.49 35.69,70 35.56,69.88 35.57,68.94 35.57,67.34 35.57,66.4 35.69,66.28 35.69,65.61 39.75,61.54 48.58,61.54 48.58,61.5 49.15,60.93 49.15,58.5 48.18,57.53
  Bottom 0.305: v105.28,67.13 104.27,66.12 103.38,66.12 U$1.STEP
D23
  Bottom 0.406: U$9.16 59.94,57.64 61.27,58.97 61.27,62.6 59.3,64.56 EXP1.5
D25
  Bottom 0.406: EXP1.6 59.32,68.01 59.78,68.01 60.44,67.34 60.44,64.25 61.85,62.84 61.85,57.01 59.94,55.1 U$9.15
D27
  Bottom 0.406: EXP1.7 61.84,63.67 62.43,63.08 62.43,54.38 U$9.14
D29
  Bottom 0.406: EXP1.8 61.86,67.99 62.32,67.99 62.98,67.32 62.98,66.38 63.02,66.34 63.02,52.43 U$9.13
D31  (via drill 0.6)
  Top 0.305: 41.78,68.34 41.33,68.33 | 41.78,68.34 42.23,68.34 42.87,68.97 42.87,69.87 44.01,70.97 44.11,71.12 66.89,71.12 67.35,71.32 69.22,71.43 71.78,71.4 v72.52,71.04 | EXP2.3 40.77,68.4 41.27,68.4 41.33,68.33 | 41.33,68.33 41.78,68.34
  Top 0.406: U$9.12 62.36,49.23 62.36,57.23 64.9,59.77 70.99,59.77 72.26,61.04 72.26,61.29 72.52,61.54 72.52,64.34 70.99,65.86 v70.48,65.86
  Bottom 0.305: v72.52,71.04 70.48,69.67 v70.48,65.86
D32  (via drill 0.35)
  Top 0.305: 72.64,23.95 U$9.3
  Top 0.508: U$9.3 73.28,23.95 74.04,24.71 v74.04,26.49
  Bottom 0.305: 102.66,25.85 102.59,25.78 102.13,25.78 75.64,25.78 74.92,26.49 v74.04,26.49
  Bottom 0.406: 102.66,25.85 108.74,31.92 108.8,31.92 109.72,32.84 111.7,32.84 112.84,33.98 112.84,36.21 U$5.DIR
D33  (via drill 0.6)
  Top 0.305: U$9.11 57.58,46.64 57.58,61.37 57.53,61.67 57.28,62.05 v57.02,62.31 | EXP2.5 43.05,68.15 v51.69,68.15
  Bottom 0.305: v57.02,62.31 51.69,67.64 v51.69,68.15
D35
  Bottom 0.305: 55.51,65.05 55.51,64.99 58.19,62.31 58.19,59.79
  Bottom 0.406: EXP1.2 55.51,68.16 55.51,65.05 | 58.19,59.79 58.19,43.49 U$9.10
D37
  Bottom 0.406: U$9.9 62.61,41.86 62.61,50.38 63.75,51.52 63.75,63.7 66.17,66.12 66.17,69.99 64.96,71.2 53.65,71.2 52.7,70.25 52.7,68.15 53.95,66.9 EXP1.1
D39  (via drill 0.6)
  Top 0.305: U$9.8 v72.64,36.65 | v105.66,48.08 109.8,48.08 110.09,48.38 113.22,48.38 114.37,49.53 114.37,50.44 v114.55,50.62
  Bottom 0.305: v105.66,48.08 104.21,46.63 104.21,46.36 103.57,45.73 102.96,45.73 92.67,35.43 86.11,35.43 84.89,36.65 v72.64,36.65 | v114.55,50.62 114.55,56.21 114.68,56.21 115.44,56.97 116.17,56.97 116.97,57.77 116.97,59.39 U$4.STEP
D40
  Top 0.305: 33.53,10.11 33.66,10.24
  Top 0.406: 33.66,10.24 38.23,10.24 39.59,8.87 U$10.6 | JP20.1 32.33,8.92 33.53,10.11
D41  (via drill 0.6)
  Top 0.305: EXP2.8 45.43,70.54 67.04,70.54 67.19,70.69 67.69,70.69 67.94,70.69 71.37,70.69 71.72,70.19 79.73,70.19 v81.15,68.91 | U$9.7 61.21,35.38 v70.23,35.38 | v70.48,50.11 72.52,52.15 v72.52,52.65
  Bottom 0.305: v70.23,35.38 70.48,35.64 v70.48,50.11 | v72.52,52.65 72.92,53.06 72.92,54.84 78.61,60.53 78.61,68.15 79.38,68.91 v81.15,68.91
D42  (via drill 0.6)
  Top 0.305: v31.88,1.09 32.85,0.63 114.68,0.68 116.46,2.46 116.46,4.9 113.41,7.95 | v106.3,10.49 109.6,13.79 110.62,13.79 114.43,17.6 114.43,22.17 113.41,23.19 101.98,23.19 100.97,24.21 v101.02,26.7 | v104.78,44.02 104.27,44.53 104.27,45.54 103.12,46.69 U$2.DIR
  Top 0.406: v113.41,8.86 113.41,7.95
  Bottom 0.305: v106.3,10.49 112.27,10.49 113.41,9.35 v113.41,8.86 | v101.02,26.7 102.42,27.95 103.57,27.95 104.22,28.6 104.22,30.38 104.78,30.94 v104.78,44.02
  Bottom 0.406: U$10.8 41.23,8.87 40.09,10.01 36.61,10.01 35.95,9.34 35.95,8.49 34.92,7.47 34.07,7.47 34.05,7.44 33.91,7.44 31.88,5.41 v31.88,1.09
D43  (via drill 0.35)  (1 unrouted)
  Top 0.305: U$2.EN R2.2 | 99.95,29.03 v99.95,30.05 | v74.3,30.3 v72.26,30.3 | U$9.6 62.1,31.57 63.63,33.1 v72.26,33.1
  Bottom 0.305: v99.95,30.05 95.38,30.05 92.08,26.75 87.9,26.75 85.84,28.8 75.79,28.8 v74.3,30.3 | v72.26,30.3 v72.26,33.1
D44  (via drill 0.6)
  Top 0.305: v99.69,22.94 98.93,24.46 v98.02,26.7 | v50.42,3.78 58.7,3.78 59.13,3.36 95.92,3.36 98.45,5.89 98.45,6.8 98.43,6.82 98.45,7.71 98.45,8.46 98.42,8.49 98.42,11.76 101.22,14.55 101.22,19.38 102.49,20.65 v103,20.65
  Bottom 0.305: v98.02,26.7 99.64,27.76 101.73,29.85 101.73,43 103,44.27 U$2.STEP | 45.96,6.68 48.86,3.78 v50.42,3.78 | v103,20.65 101.98,20.65 v99.69,22.94
  Bottom 0.406: 45.96,6.68 45.17,7.47 43.3,7.47 U$10.7
D45  (via drill 0.6)
  Top 0.305: v74.55,31.57 71.4,31.57 68.86,29.03 U$9.5 | v86.74,29.29 84.78,31.25 84.27,31.25 R18.2
  Top 0.406: R18.2 R22.2
  Top 0.508: R22.2 84.27,32.97 84.27,31.25
  Bottom 0.305: v74.55,31.57 74.87,31.25 R18.2 86.04,29.29 v86.74,29.29
D47  (via drill 0.6)
  Top 0.305: U$9.4 71.37,26.49 v72.64,25.22
  Bottom 0.305: v72.64,25.22 107.37,25.31 107.94,24.74 122.07,24.74 122.68,25.35 124.08,25.35 124.97,26.24 124.97,43.26 124.26,43.97 124.26,44.02 123.7,44.02 U$5.STEP
D49  (via drill 0.35)
  Top 0.305: EXP2.7 44.82,66.89 46.36,65.35 50.42,65.35 v51.44,66.37 | v56.77,61.04 56.77,33.86 57.78,32.84 62.1,32.84 v63.12,33.86
  Bottom 0.305: v51.44,66.37 v56.77,61.04 | v63.12,33.86 63.12,28.4 63.42,28.1 63.42,21.08 63.07,20.73 63.07,4.09 61.85,2.87 61.09,2.87 60.07,3.89 60.07,6.3 U$3.2
D53
  Bottom 0.305: 56.92,13.19 57.02,13.09 57.02,13.07 57.02,13.05 58.7,11.26 58.7,9.34
  Bottom 0.406: 58.7,9.34 58.7,8.4 58.03,7.74 56.43,7.74 U$3.6 | 56.92,13.19 56.67,43.36 56.67,45.21 56.21,45.67 56.21,59.12 50.15,65.18 41.31,65.18 40.51,65.97 40.51,68.15 EXP2.4
D57  (via drill 0.6)
  Top 0.305: 121.28,23.7 121.03,23.44 121.03,20.02 106.7,5.69 106.7,4.93 106.02,4.24 105.05,4.24 105.05,4.25 102.02,1.22 34.14,1.29 33.78,1.35 32.48,2.08 32.49,2.08 32.44,2.13 | v121.28,29.03 U$5.EN R4.2
  Top 0.406: 23.68,5.79 JP5.5 23.77,5.89 27.56,2.11 32.45,2.11 32.48,2.08 | v121.28,27 121.28,23.7
  Bottom 0.305: v121.28,27 v121.28,29.03
D58  (via drill 0.6)
  Top 0.305: 119,50.62 R3.2 | 119,50.62 120.78,50.62 | v119.76,23.19 120.27,22.68 120.27,20.4 106.45,6.58 105,6.68 100.58,1.85 46.74,1.85 46.69,1.81 46.02,1.81 45.97,1.85 37.16,1.85 35.63,3.38 29.34,3.38 26.42,6.3 JP5.7 | 119,50.62 U$4.EN
  Top 0.406: R3.2 U$4.EN
  Bottom 0.305: v119.76,23.19 124.84,23.19 125.86,24.21 125.86,47.32 123.44,49.73 U$4.EN
D63  (via drill 0.6)
  Top 0.305: 43.78,3.28 44.52,3.48 47.12,3.48 47.72,2.88 99.06,2.88 101.44,5.25 104.27,7.44 106.3,7.44 118.75,19.89 118.75,26.75 116.7,27.52 arc90 116.71,27.51 106.05,27.51 105.03,28.52 v105.03,30.05 | 43.78,3.28 43.56,3.17 | v105.64,45.59 104.27,47.07 104.27,50.11 | 43.78,3.28 43.63,3.12 v43.56,3.12
  Top 0.406: U$10.4 38.23,7.73 v38.23,7.7 | 104.27,50.11 103.76,50.62 U$1.EN R1.2
  Bottom 0.305: v105.03,30.05 105.54,30.56 v105.64,45.59
  Bottom 0.406: v38.23,7.7 39.87,7.7 40.76,6.8 40.76,5.93 v43.56,3.12
GND  (via drill 0.35, 0.6)  (2 unrouted)
  Top 0.305: 81.53,35.38 R21.1 | 112.52,33.35 v112.52,37.92 | v71.63,38.43 C8.- | v73.41,43 v73.41,45.54 C7.- | v73.41,51.64 75.84,49.2 75.84,48.52 75.95,48.41 v75.69,48.21 75.36,48.21 75.28,48.28 | 92.13,39.5 92.2,39.57 94.07,41.45 C4.- 94.21,43.13 | C1.- 90.42,68.24 U$1.GND | 113.37,51.8 113.28,51.89 v113.16,51.89 | C2.- 114.17,64.37 v114.17,62.81 | 70.52,18.91 70.52,16.62 v70.48,16.59
  Top 0.406: R7.1 124.73,50.94 123.87,51.8 113.37,51.8 | 94.07,43.16 C4.- | 94.07,64.75 C1.- | 114.39,64.75 C2.- | 114.39,43.16 C3.- | C9.1 36.6,58.97 36.58,57.97 36.58,56.13 JP7.2 JP8.2 JP9.2 | C10.1 41.68,58.71 41.66,57.97 41.66,56.13 JP9.2 | C11.1 47.52,58.97 46.74,57.97 46.74,56.13 JP11.2 | JP9.2 JP10.2 JP11.2 | JP11.2 JP12.2 50.65,54.94 CN5.2 | 70.52,18.91 70.21,19.22 62.13,19.22 U$9.2 | EXP1.9 65.18,67.64 J1.1 72.88,67.03 75.56,64.34 75.56,60.89 C6.- 74.42,59.03 74.42,56.7 v74.42,55.19 75.92,53.69 C5.- | U$5.GND@0 109.95,30.78 109.95,30.71 109.45,30.21 107.79,30.21 R6.1 | U$4.GND@0 108.52,50.94 R5.1 104.41,50.94 103.46,51.89 101.47,51.89 101.21,52.16 100.56,52.16 v100.5,52.11
  Top 0.508: v94.36,44.78 94.36,43.29 94.21,43.13 | 74.01,55.19 v74.42,55.19 | LED5.C 64.7,56.7 74.42,56.7 | JP2.1 2.73,3.37 CN8.1 | v127.64,29.54 126.17,29.54 R8.1 125.17,30.17 125,30.17 124.91,30.26 115.57,30.26 115.51,30.33 114.8,30.33 113.56,31.57 110.89,31.57 | 110.89,31.57 U$5.GND@0 | 110.89,31.57 109.47,30.15 107.74,30.15 R6.1 | 114.39,43.16 U$5.GND | C3.- 115.06,42.33 v115.06,40.46 | C8.- 76.45,37.9 R19.1 R20.1 R21.1 R22.1
  Top 0.813: U$2.GND@0 90.42,32.22 91.76,33.56 91.76,39.13 92.2,39.57 93.85,41.22 93.85,43.26 | v112.52,37.92 112.65,37.8 112.65,33.1 112.27,33.1 U$5.GND@0
  Top 1.016: v110.87,71.45 110.74,71.32 U$4.GND
  Top 1.422: 75.53,48.04 75.28,48.28 75.28,49.76 73.72,51.32
  Bottom 0.305: v112.52,37.92 v115.06,40.46 | v71.63,38.43 71.84,38.38 71.84,39.53 73.41,41.1 v73.41,43 | v74.42,55.19 73.41,54.18 v73.41,51.64 | v75.69,48.21 75.74,47.87 75.1,47.87 74.63,47.4 74.63,46.26 v73.41,45.54 | CN8.4 10.71,5.58 12.57,7.44 17.91,7.44
  Bottom 0.406: JP8.2 37.92,54.09 36.73,52.89 36.73,51.91 37.92,50.71 | CN8.1 CN8.2 CN8.3 CN8.4 | 30.1,1.35 23.27,1.35 20.95,1.35 CN9.2 19.73,3.17 19.73,5.61 19.91,5.79 19.91,6.8 19.2,7.52 18.19,7.52 18.11,7.44 17.91,7.44 | 50.37,47.12 49.36,46.11 49.58,45.89 50.55,46.86 50.55,46.94 50.37,47.12 | 50.37,47.12 51.94,48.69 51.94,52.95 50.67,54.22 CN5.2 | JP17.1 49.3,46.5 49.92,47.12 50.37,47.12 | 121.14,51.8 122.31,52.97 122.31,53.63 123.11,54.43 | 123.11,54.43 127.64,54.43 | 123.11,54.43 122.56,54.43 122.05,54.94 122.05,56.97 125.6,56.97 124.84,57.73 124.84,59.51 121.79,59.51 121.79,62.05 121.93,62.19 123.91,62.19 124.03,62.31 125.09,62.31 124.71,61.92 122.97,61.92 122.85,61.8 122.56,61.8 | U$5.GND@0 111.43,32.26 111.94,32.26 113.42,33.74 113.42,35.97 123.13,45.68 123.91,45.68 124.58,46.34 124.58,47.28 123.91,47.95 122.97,47.95 122.31,47.28 122.31,46.5 111.05,35.25 110.27,35.25 109.14,34.11 108.2,34.11 108.2,43 112.63,43 117.16,47.53 117.16,48.63 116.38,49.42 113.84,49.42 111.3,51.96 90.85,51.96 | U$2.GND 90.68,46.56 91.82,46.56 91.57,46.3 91.57,45.54 89.53,45.54 89.03,45.03 89.03,43 92.08,43 91.82,42.75 91.82,40.46 89.03,40.46 88.77,40.21 88.77,37.67 89.03,37.92 92.08,37.92 | JP7.2 33.55,56.77 33.55,65.86 33.66,65.76 33.66,61.29
  Bottom 0.508: v127.64,29.54 127.89,29.79
  Bottom 1.016: U$4.GND 110.74,67.9 112.19,66.46 112.19,55.11 110.74,53.67 U$4.GND@0
  Bottom 1.27: 72.52,67.89 72.52,68.4 71.5,68.4 71.5,68.15 71.75,68.15 71.75,68.4 73.53,68.4 73.53,68.71 74.5,68.71 72.92,67.13 72.77,67.13 72.77,67.39 71.5,67.39 71.5,67.64 J1.1
  pour Bottom: 0,0.46 0,13.67 33.27,13.79 54.23,13.79 54.74,41.99 33.78,41.86 32.89,42.49 33.02,72.97 129.54,73.48 129.54,13.28 116.46,0.08
MISO
  Bottom 0.406: EXP2.1 36.7,66.09 36.82,65.98 36.91,65.98 38.41,64.48 49.77,64.48 55.25,59 55.25,44.02 55.98,43.28 55.98,43.16 56.13,14.05 56.26,13.92 56.26,12.27 57.56,10.97 U$3.3
MOSI
  Bottom 0.406: U$3.4 58.97,7.74 60.57,7.74 61.24,8.4 61.24,9.34 57.56,13.28 57.25,59.21 50.31,66.1 48.26,68.15 43.05,68.15 EXP2.6 | EXP2.6
N$1
  Top 0.813: 89.55,55.7 U$1.2B
  Top 1.27: CN7.1 86.82,58.19 CN1.1 87.01,58.24 89.55,55.7
N$2
  Top 0.508: R27.2 LED5.A
N$3
  Top 0.813: 89.41,60.78 U$1.1A
  Top 1.27: CN7.3 86.82,63.27 CN1.3 89.41,60.78
N$4
  Top 0.813: 89.41,63.32 U$1.1B
  Top 1.27: CN7.4 86.82,65.81 CN1.4 89.41,63.32
N$5
  Top 1.27: CN2.1 89.15,34.11 U$2.2B
N$6
  Top 1.27: CN2.2 89.15,36.65 U$2.2A
N$7
  Top 1.27: CN2.3 89.15,39.19 U$2.1A
N$8
  Top 1.27: CN2.4 89.15,41.73 U$2.1B
N$9
  Top 1.27: U$4.2B CN3.1 CN6.1
N$10
  Top 1.27: U$4.2A CN3.2 CN6.2
N$11
  Top 1.27: U$4.1A CN3.3 CN6.3
N$12
  Top 0.813: U$4.1B 110.11,63.32
  Top 1.27: 110.86,63.32 110.11,63.32 CN3.4 CN6.4
N$13
  Top 1.27: U$5.2B CN4.1
N$14
  Top 1.27: U$5.2A CN4.2
N$15
  Top 1.27: CN4.3 U$5.1A
N$16
  Top 0.61: 107.57,41.73 CN4.4
  Top 1.27: U$5.1B 107.57,41.73
N$17  (1 unrouted)
  Bottom 1.27: J1.2 77.09,67.64 77.09,61.04 69.47,61.04 | 69.47,61.04 69.47,62.56 70.23,62.56 70.23,62.05 76.07,62.05 | 76.33,62.05 76.07,62.05 | 76.07,62.05 76.07,62.81 75.31,62.81 75.31,62.56 | 69.47,61.04 67.44,63.07 67.44,63.32 | 70.52,63.42 71.6,63.42 75.31,67.13
  Bottom 2.54: J1.2 76.38,64.64 76.33,64.59 75.82,65.1 74.3,63.58 F1.1
N$18
  Top 0.406: SV1.1 U$1.MS1 103.44,52.84 R5.2
N$19
  Top 0.406: SV1.3 U$1.MS2
N$20
  Top 0.406: SV1.5 U$1.MS3
N$21
  Top 0.406: SV2.1 U$2.MS1 103.44,31.25 R6.2
N$22
  Top 0.406: SV2.3 U$2.MS2
N$23
  Top 0.406: SV2.5 U$2.MS3
N$24
  Top 0.406: SV3.1 U$4.MS1 123.76,52.84 R7.2
N$25
  Top 0.406: SV3.3 U$4.MS2
N$26
  Top 0.406: SV3.5 U$4.MS3
N$27
  Top 0.406: SV4.1 U$5.MS1 123.76,31.25 R8.2
N$28
  Top 0.406: SV4.3 U$5.MS2
N$29
  Top 0.406: SV4.5 U$5.MS3
N$30  (via drill 0.6)
  Top 0.305: LED1.C 71.15,6.68 v71.25,6.68 | 77.26,9.7 78.06,9.7
  Top 0.813: v74.3,9.73 77.24,9.73 77.26,9.7
  Top 2.54: 78.06,8.4 J2.1 79.02,12.42 80.65,14.05 80.65,17.6 Q1.D 76.99,17.32 78.46,17.32 79.78,16 79.78,14.13 78.06,12.4 78.06,9.7 78.06,8.4
  Bottom 0.406: v71.25,6.68 v74.3,9.73
N$31
  pour Top: 0,-0.18 -0.25,13.54 54.48,13.79 54.48,41.99 32.89,41.99 33.02,73.48 129.54,73.48 129.67,13.28 129.54,13.16 116.33,-0.18
N$32
  Top 0.813: U$2.SLP U$2.RST
N$33
  Top 0.813: U$1.SLP U$1.RST
N$34
  Top 0.813: U$4.SLP U$4.RST
N$35
  Top 0.813: U$5.SLP U$5.RST
N$36
  Top 0.305: 87,17.6 86.74,17.6
  Top 0.406: J3.1 86.13,6.43 85.22,5.52 85.22,5.49 80.99,5.49 74.8,5.43 74.53,5.43 71.75,8.2 70.74,8.2 69.72,7.19 LED2.C
  Top 2.54: 86.74,17.6 86.49,17.68 83.69,17.86 83.69,13.79 J3.1 85.53,13.16 84.56,14.13 84.56,16 84.93,16.37 | Q2.D 87,17.6
N$37  (via drill 0.6)
  Top 0.305: v71.63,17.09 71.58,13.03 71.5,12.96 71.5,11.25 69.98,9.73 LED3.C
  Top 2.54: Q3.D 97.93,17.86 97.66,17.58 97.06,17.58 97.01,17.53 94.36,17.35 J4.1 95.73,16.06 95.73,16.25 95.81,16.33 95.88,16.59
  Bottom 0.406: Q3.D 95.57,17.86 91,22.43 75.56,22.43 74.3,21.16 74.3,18.87 72.52,17.09 v71.63,17.09
N$38  (via drill 0.6)
  Top 0.305: v69.7,18.16 69.7,16.94 69.68,16.92 69.68,16.25 70.74,15.19 70.74,13.28 69.72,12.27 LED4.C
  Top 2.54: Q4.D 107.06,17.86 104.27,15.06 104.27,11.52 102.78,10.04 J5.1 104.52,16.84 106.05,17.86 104.78,13.03
  Bottom 0.406: Q4.D 105.31,17.86 104.29,18.87 103,18.87 99.79,22.08 99.34,22.08 98.84,22.58 98.84,22.65 98.17,23.32 75.44,23.32 73.28,21.16 73.28,19.13 72.31,18.16 v69.7,18.16
N$39
  Top 0.305: R11.2 LED1.A
N$40
  Top 0.305: R12.2 LED2.A
N$41
  Top 0.305: LED3.A R13.2
N$42
  Top 0.305: R14.2 LED4.A
N$44
  Top 0.813: U$1.2A 89.41,58.24 CN1.2
  Top 1.27: 86.82,60.73 CN7.2 | 86.82,60.73 CN1.2 | 89.41,58.24 89.31,58.24 86.82,60.73
N$46
  Top 0.508: Q2.G 84.07,20.14 78.99,25.22 R16.1
N$47
  Top 0.508: R17.1 81.53,26.37 82.68,25.22 90.04,25.22 94.87,20.4 Q3.G
N$48
  Top 0.508: Q4.G 108.02,20.65 106.75,21.92 99.05,21.92 94.98,25.98 84.62,25.98 84.07,26.53 R18.1
N$49
  Top 0.508: R15.1 76.45,20.4 Q1.G
P20
  Bottom 0.305: JP19.1 46.74,49.84 46.99,57.95 47.79,58.75 49.4,58.75 50.65,57.51 CN5.3
P21  (via drill 0.6)
  Top 0.305: v49.4,56.26 49.45,56.31 49.45,58.01 50.67,59.23 CN5.4
  Bottom 0.305: JP18.1 49.4,49.71 v49.4,56.26
SCK
  Bottom 0.406: U$3.5 55.02,9.76 55.5,10.24 55.5,16.32 55.49,16.33 55.3,42.38 53.72,43.96 53.72,59.51 50.16,63.07 38.48,63.07 36.96,64.59 36.4,64.59 35.62,65.36 35.62,66.31 35.56,66.37 35.56,68.28 EXP2.2
TX
  Top 0.406: JP5.6 23.06,10.11 19.81,10.06 17.72,10.06 16.37,8.71 R9.2

### Text on the board
tPlace: - + | EXP2 | EXP1 | R23 | E2 | E3 | VCC | C4 | C3 | 0.47uF | 0.47uF | 0.47uF | 4.7k | 100uF | 100uF | C9 | C10 | C11 | C8 | 10uF | F1 | LED5 | R24 | 4.7k | Power | C7 | T3 | R5 | Endstops | R27 | R1 | 10k | R3 | 10k | R7 | SDA | SCL | 10uF | R25 | 100k | 100k | S | X- | 1.8k | 4.7k | S | Y- | I2C | C6 | C1 | C2 | S | Z- | +5V | GND | AUX 4 | 10uF | R26 | 100uF | 100uF | 4.7k | T6 | 10uF | Thermistors | C5 | R19 | R20 | R21 | R22 | E5 | 100k | V2.1 | R6 | R8 | 10r | R2 | 10k | R4 | 10k | R15 | R16 | R17 | R18 | E4 | 100k | 100k | Heaters/Fans | RAMPS Expansion Board | RAMPSXB | Heaters | 5V | Q2 | Q3 | Q4 | - + | AUX 2 | AUX 3 | 1.8k | Q1 | AUX 1 | LED4 | PWM | R11 | R9 | R12 | LED3 | VCC | 2.2k | D40 | R13 | LED2 | H3 | H6 | 3.3k | R10 | R14 | LED1 | S | 5V | HC-05 | + - | Servo | +5V | GND | TX | RX | http://reprap.org/wiki/RAMPSXB | + - | + - | + - | + -
tValues: Disc | Pin | EXP2 | D52 | D53 | D51 | D41 | NC | E2 | STEP | D19 | D50 | D31 | D33 | D49 | NC | DIR | D15 | EN | D63 | EXP1 | E3 | STEP | D39 | D35 | D16 | D25 | D29 | +5V | DIR | D2 | D37 | D17 | D23 | D27 | GND | EN | D58 | E4 | STEP | D44 | DIR | D42 | D43 | EN | E5 | STEP | D47 | DIR | D32 | EN | D57 | Thermistor 3 | A11 | +5V | Thermistor 4 | A12 | GND | D18 | D20 | D21 | Thermistor 5 | A10 | +5V | GND | D14 | +5V | GND | Thermistor 6 | A5 | I2C | Developed by S.Z. | +5V | GND | D3 | MOSFET 3 | D4 | Endstops | MOSFET 4 | D5 | MOSFET 5 | D6 | MOSFET 6 | D45 | PWM | D6 | D5 | D4 | D40 | GND | GND | GND | GND | +5V | +5V | +5V | +5V | +5V Power | GND | +5V | D11 | +5V | GND | D1 | D0 | GND | GND | GND | GND | Servo | HC-05 | VCC | VCC | VCC | VCC | VCC Power